# Altium schematic sheet output_module.SchDoc
size A3
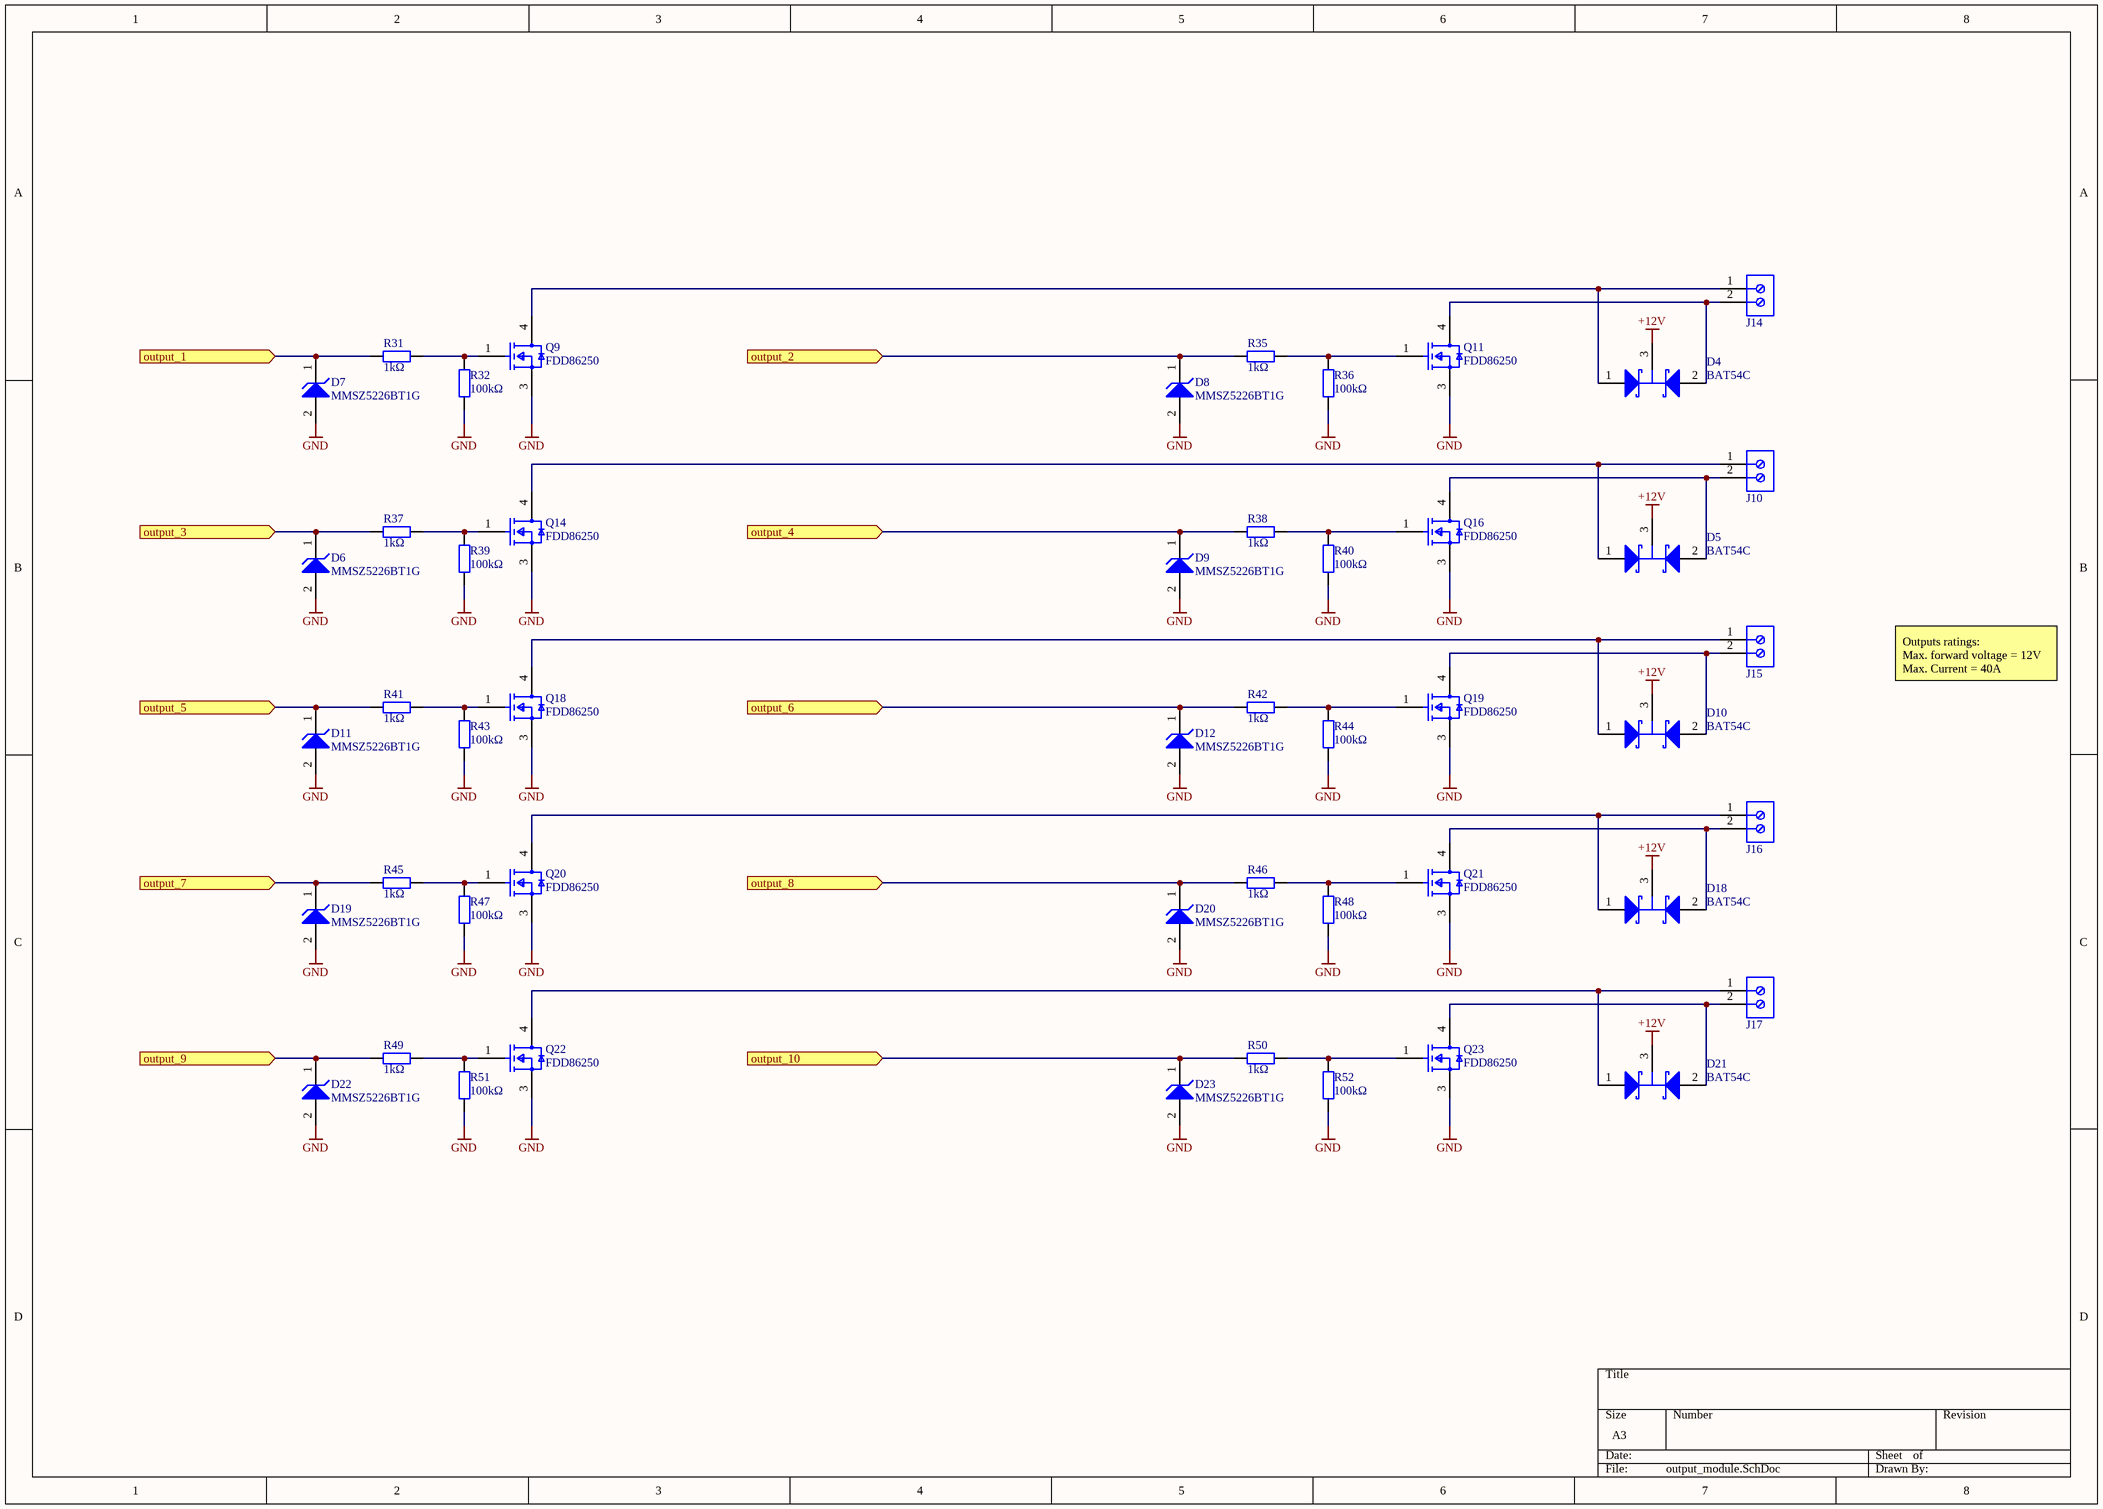
[diagram p0: output_module.SchDoc]

## Parts
D4  BAT54C  [SOT-23]
D5  BAT54C  [SOT-23]
D6  MMSZ5226BT1G  [ONSC-SOD-123-2-425-04_V]
D7  MMSZ5226BT1G  [ONSC-SOD-123-2-425-04_V]
D8  MMSZ5226BT1G  [ONSC-SOD-123-2-425-04_V]
D9  MMSZ5226BT1G  [ONSC-SOD-123-2-425-04_V]
D10  BAT54C  [SOT-23]
D11  MMSZ5226BT1G  [ONSC-SOD-123-2-425-04_V]
D12  MMSZ5226BT1G  [ONSC-SOD-123-2-425-04_V]
D18  BAT54C  [SOT-23]
D19  MMSZ5226BT1G  [ONSC-SOD-123-2-425-04_V]
D20  MMSZ5226BT1G  [ONSC-SOD-123-2-425-04_V]
D21  BAT54C  [SOT-23]
D22  MMSZ5226BT1G  [ONSC-SOD-123-2-425-04_V]
D23  MMSZ5226BT1G  [ONSC-SOD-123-2-425-04_V]
J10  282836-2  [TECO-282836-2_V]  (value not drawn)
J14  282836-2  [TECO-282836-2_V]  (value not drawn)
J15  282836-2  [TECO-282836-2_V]  (value not drawn)
J16  282836-2  [TECO-282836-2_V]  (value not drawn)
J17  282836-2  [TECO-282836-2_V]  (value not drawn)
Q9  FDD86250  [FP-369AS-MFG]
Q11  FDD86250  [FP-369AS-MFG]
Q14  FDD86250  [FP-369AS-MFG]
Q16  FDD86250  [FP-369AS-MFG]
Q18  FDD86250  [FP-369AS-MFG]
Q19  FDD86250  [FP-369AS-MFG]
Q20  FDD86250  [FP-369AS-MFG]
Q21  FDD86250  [FP-369AS-MFG]
Q22  FDD86250  [FP-369AS-MFG]
Q23  FDD86250  [FP-369AS-MFG]
R31  1kΩ  [RESC2013X50X30ML20T20]
R32  100kΩ  [RESC2013X50X30ML20T20]
R35  1kΩ  [RESC2013X50X30ML20T20]
R36  100kΩ  [RESC2013X50X30ML20T20]
R37  1kΩ  [RESC2013X50X30ML20T20]
R38  1kΩ  [RESC2013X50X30ML20T20]
R39  100kΩ  [RESC2013X50X30ML20T20]
R40  100kΩ  [RESC2013X50X30ML20T20]
R41  1kΩ  [RESC2013X50X30ML20T20]
R42  1kΩ  [RESC2013X50X30ML20T20]
R43  100kΩ  [RESC2013X50X30ML20T20]
R44  100kΩ  [RESC2013X50X30ML20T20]
R45  1kΩ  [RESC2013X50X30ML20T20]
R46  1kΩ  [RESC2013X50X30ML20T20]
R47  100kΩ  [RESC2013X50X30ML20T20]
R48  100kΩ  [RESC2013X50X30ML20T20]
R49  1kΩ  [RESC2013X50X30ML20T20]
R50  1kΩ  [RESC2013X50X30ML20T20]
R51  100kΩ  [RESC2013X50X30ML20T20]
R52  100kΩ  [RESC2013X50X30ML20T20]

## Ports
output_1 (in), output_2 (in), output_3 (in), output_4 (in), output_5 (in), output_6 (in), output_7 (in), output_8 (in), output_9 (in), output_10 (in)

## Nets
+12V: D4.3(K) D5.3(K) D10.3(K) D18.3(K) D21.3(K)
GND: D6.2(A) D7.2(A) D8.2(A) D9.2(A) D11.2(A) D12.2(A) D19.2(A) D20.2(A) D22.2(A) D23.2(A) Q9.3(S) Q11.3(S) Q14.3(S) Q16.3(S) Q18.3(S) Q19.3(S) Q20.3(S) Q21.3(S) Q22.3(S) Q23.3(S) R32.1 R36.1 R39.1 R40.1 R43.1 R44.1 R47.1 R48.1 R51.1 R52.1
output_1: D7.1(K) R31.1 ; port output_1
output_2: D8.1(K) R35.1 ; port output_2
output_3: D6.1(K) R37.1 ; port output_3
output_4: D9.1(K) R38.1 ; port output_4
output_5: D11.1(K) R41.1 ; port output_5
output_6: D12.1(K) R42.1 ; port output_6
output_7: D19.1(K) R45.1 ; port output_7
output_8: D20.1(K) R46.1 ; port output_8
output_9: D22.1(K) R49.1 ; port output_9
output_10: D23.1(K) R50.1 ; port output_10
NetD4_1: D4.1(A) J14.1 Q9.4(D)
NetD4_2: D4.2(A) J14.2 Q11.4(D)
NetD5_1: D5.1(A) J10.1 Q14.4(D)
NetD5_2: D5.2(A) J10.2 Q16.4(D)
NetD10_1: D10.1(A) J15.1 Q18.4(D)
NetD10_2: D10.2(A) J15.2 Q19.4(D)
NetD18_1: D18.1(A) J16.1 Q20.4(D)
NetD18_2: D18.2(A) J16.2 Q21.4(D)
NetD21_1: D21.1(A) J17.1 Q22.4(D)
NetD21_2: D21.2(A) J17.2 Q23.4(D)
NetQ9_1: Q9.1(G) R31.2 R32.2
NetQ11_1: Q11.1(G) R35.2 R36.2
NetQ14_1: Q14.1(G) R37.2 R39.2
NetQ16_1: Q16.1(G) R38.2 R40.2
NetQ18_1: Q18.1(G) R41.2 R43.2
NetQ19_1: Q19.1(G) R42.2 R44.2
NetQ20_1: Q20.1(G) R45.2 R47.2
NetQ21_1: Q21.1(G) R46.2 R48.2
NetQ22_1: Q22.1(G) R49.2 R51.2
NetQ23_1: Q23.1(G) R50.2 R52.2

## Notes on the sheet
- Outputs ratings:
  Max. forward voltage = 12V
  Max. Current = 40A

## Library data of the parts
D4 D5 D10 D18 D21 = DIODE_BAT54C: Schottky Barrier Diode, 30 V, 3-Pin SOT23, RoHS, Tape and Reel; Manufacturer: NXP Semiconductors; Forward Surge Current Ifsm Max: 600mA; Pin Configuration: 1A1,2A2,3comK; Package Version: Feb-16; Forward Voltage VF Max: 800mV; SMD Marking: L43/*W1; Reverse Recovery Time trr Typ: 5ns; Forward Current If(AV): 200mA; Reel Quantity: 3000; SVHC: NoSVHC(19-Dec-2012); No. of Pins: 3; Junction Temperature Tj Max: 125degC; Common Connection: Cathode; Repetitive Reverse Voltage Vrrm Max: 30V; Operating Temperature Max: 150degC; Operating Temperature Range: -65degCto+150degC; Diode Case Style: SOT-23; Termination Type: SMD; Package Description: 3-Pin Small Outline Transistor, Body 1.3 x 2.9 mm, Pitch 0.95 mm; Package / Case: SOT-23; Diode Type: Schottky; Manufacturer URL: http://www.nxp.com/; Tape Width: 8mm; Package Reference: SOT23-3; Datasheet URL: https://datasheet.ciiva.com/33723/1668625-33723936.pdf; Datasheet Version: Rev. 5 , 10/2012; Operating Temperature Min: -65degC; Current Ifsm: 600mA; Reverse Recovery Time trr Max: 5ns; Package URL: http://www.nxp.com/documents/outline_drawing/SOT23.pdf; Forward Voltage: 800mV
D6-D9 D11 D12 D19 D20 D22 D23 = CMP-1060-00363-1: Zener Voltage Regulator, 500 mW, 2-Pin SOD-123, Pb-Free, Tape and Reel; Manufacturer: On Semiconductor; P Max (W): 0.5; VZ Typ (V): 3.3; PartNumber: MMSZ5226BT1G; ComponentLink1Description: Manufacturer URL; ComponentLink3URL: http://www.onsemi.com/pub_link/Collateral/425-04.PDF; ComponentLink3Description: Package Specification; ComponentLink2Description: Datasheet; ComponentLink1URL: http://www.onsemi.com/; Mounting Technology: Surface Mount; Packing: Tape and Reel; PackageDescription: 2-Pin SOD, Body 1.6 x 2.69 mm; ComponentLink2URL: http://www.onsemi.com/pub_link/Collateral/MMSZ5221BT1-D.PDF; RoHS: Pb-Free; PackageVersion: Rev. G, 10/2009; PackageReference: SOD-123-2-425-04; DatasheetVersion: Rev. 12
J10 J14-J17 = CMP-1684-00017-1: Female Header, Pitch 5 mm, 1 x 2 Position, Height 10 mm, Tail Length 3.5 mm, Rohs, Bulk; Manufacturer: TE Connectivity; Wire Gauge: 16-30AWG; Product Training Modules: Wire-to-BoardEurostyleTerminalBlocks; Clamp Material - Plating: Brass-NickelPlated; Voltage: 300V; Mating Orientation: HorizontalwithBoard; Current: 13.5A; Pitch: 0.197"(5.00mm); Screw Thread: M3; 3D Model: 282836-2.pdf; Other Names: 5ULV-02B / A98076; Dynamic Catalog: BuchananSeries; Number of Levels: 1; Torque - Screw: 0.68Nm(6Lb-In); Featured Product: EurostyleTerminalBlockConnectors; Positions Per Level: 2; Wire Termination: Screw-RisingCageClamp; Datasheet URL: http://www.te.com.cn/commerce/DocumentDelivery/DDEController?Action=showdoc&DocId=Catalog+Section%7F1308389_EUROSTYLE_TERMINAL_BLOCKS%7F0607%7Fpdf%7FEnglish%7FENG_CS_1308389_EUROSTYLE_TERMINAL_BLOCKS_0607.pdf%7F282836-2; Color: Green; Family: TerminalBlocks-WiretoBoard; RoHS Information: 282836-2StatementofCompliance; Standard Package: 300; Contact Material - Plating: Brass-TinPlated; Manufacturer URL: http://www.te.com; Housing Material: Polyamide(PA66),Nylon6/6; Features: Interlocking(Side); Package Description: Female Header, Pitch 5 mm, 1 x 2 Position, Height 10 mm, Tail Length 3.5 mm; Mounting Type: ThroughHole; Package Reference: THD; Packaging: Bulk; Series: Buchanan; Category: Connectors,Interconnects; Screw Material - Plating: Brass-NickelPlated
Q9 Q11 Q14 Q16 Q18-Q23 = CMP-07173-000037-1: MOSFET N-CH 150V 8A DPAK; Manufacturer: ON Semiconductor; Threshold Vgs Max: 4V; Power Dissipation: 3.1W; Gate Charge At Vgs: 23nC @ 10V; Turn On Delay Time: 11.2ns; Reverse Recovery Charge: 104nC; Max Forward Diode Voltage: 1.3V; Pulse Drain Current: 164A; Max Junction Temp: +150°C; Depletion Mode: False; Rthja Max: 40°C/W; Input Capacitace At Vds: 1585pF @ 75V; Number Of N Channels: 1; Gate To Source Voltage: 20V; Reverse Recovery Time: 71ns; Threshold Vgs Min: 2V; Typ Forward Diode Voltage: 0.78V; Transconductance: 28S; Drain To Source Resistance: 18.4mΩ; Turn Off Delay Time: 20ns; Footprint Url: https://www.onsemi.com/pub/Collateral/369AS.PDF; Automotive: No; Continuous Drain Current: 8A; Digikey Description: MOSFET N-CH 150V 8A DPAK; RoHS: TRUE; Device Class L1: Discrete Semiconductors; ComponentLink2URL: https://www.onsemi.com/pub/Collateral/FDD86250-D.pdf; Lead Free: Yes; Drain To Source Breakdown Voltage: 150V; Octopart: https://octopart.com/fdd86250-on+semiconductor-84325855; Temperature Range Low: -55°C; Device Class L3: MOSFETs; Manufacturer Part Number: FDD86250; Package: 369AS; Temperature Range High: +150°C; Category: Trans; Mouser Description: Shielded Gate PowerTrench® MOSFET, N-Channel, 150 V, 51 A, 22 mO; ComponentLink2Description: Datasheet; Temperature: -55°C to +150°C; Drain To Source Voltage: 150V; Number Of Channels: 1; Height: 2.517mm; Device Class L2: Transistors
R31 R32 R35-R52 = Res_0805: Resistor